# Altium schematic sheet Youtube_Top.SchDoc
size A4; SheetNumber: 1; SheetTotal: 1
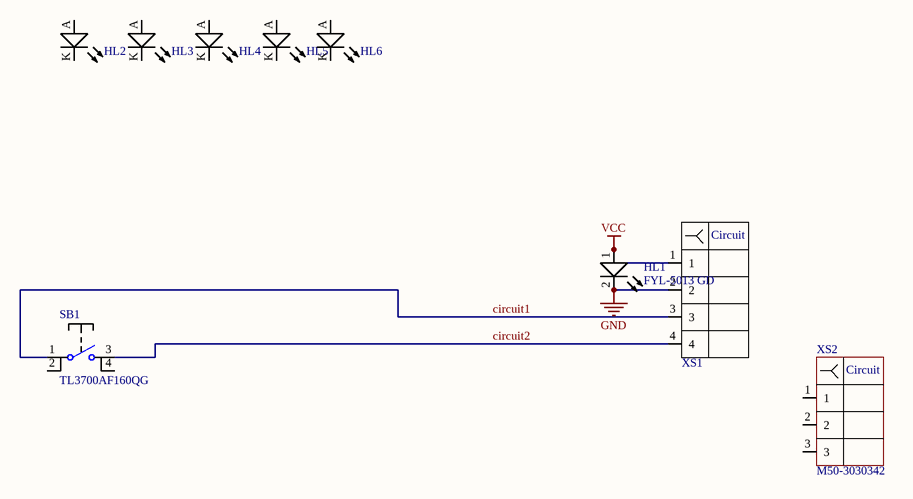
[diagram p0: Youtube_Top.SchDoc]

## Parts
HL1  FYL-5013 GD  [LED_3MM_GREEN]
HL2  RD 0603  [LED-0603-RED]  (value not drawn)
HL3  RD 0603  [LED-0603-RED]  (value not drawn)
HL4  RD 0603  [LED-0603-RED]  (value not drawn)
HL5  RD 0603  [LED-0603-RED]  (value not drawn)
HL6  RD 0603  [LED-0603-RED]  (value not drawn)
SB1  TL3700AF160QG  [TL3700AF160QG]
XS1  PBS-4  [PBS-4-3D]  (value not drawn)
XS2  M50-3030342  [PBLS-1.27-3]

## Nets
GND: HL1.2(K) XS1.2
VCC: HL1.1(A) XS1.1
circuit1: SB1.1(COMMON) XS1.3
circuit2: SB1.3(COMMON) XS1.4

Not connected (* = marked no-connect by the designer): HL2 A K; HL3 A K; HL4 A K; HL5 A K; HL6 A K; SB1 2(NO) 4(COMMON); XS2 1 2 3

## Notes on the sheet
- (in symbol M20-7820442) Circuit
- (in symbol M50-3030342) Circuit

## Library data of the parts
HL2-HL6 = 150060RS55040: LED RED DIFFUSED 0603 SMD; Part Number: 150060RS55040; HelpURL: https://www.digikey.com/products/en?keywords=732-12015-1-ND; Digi-Key Part Number: 732-12015-1-ND; Price$: 0.17; Manufacturer Part Number: 150060RS55040
SB1 = TL3700AF160QG: SWITCH TACTILE SPST-NO 0.02A 15V; Part Number: TL3700AF160QG; HelpURL: https://www.digikey.com/product-detail/en/e-switch/TL3700AF160QG/EG4919CT-ND/2538592; Digi-Key Part Number: EG4919CT-ND
XS1 = M20-7820442: Headers & Wire Housings 4 PIN SIL VERTICAL SOCKET GOLD+TIN; System: Connector; Part Number: M20-7820442; HelpURL: https://www.mouser.co.uk/ProductDetail/Harwin/M20-7820442?qs=vF78I%252BjhbY9ZgDLCXkGx4w%3D%3D; Manufacturer Part Number: M20-7820442; Package: Header 4POS 2.54mm; Mouser Part Number: 855-M20-7820442
XS2 = M50-3030342: Headers & Wire Housings 3 WAY SIL VERT PC TAIL SKT; Part Number: M50-3030342; HelpURL: https://eu.mouser.com/ProductDetail/Harwin/M50-3030342?qs=sGAEpiMZZMs%252BGHln7q6pm8Vn94ktop%2FJCT2ZrMcJQ%2F%2FaTd%2FpiUltJA%3D%3D; Price$: 0.306; Manufacturer Part Number: M50-3030342; Mouser Part Number: 855-M50-3030342
HL1 = FYL-5013 GD: Part Number: FYL-5013 GD